# Altium schematic sheet Microcontroller.SchDoc
size 381 x 241 mm
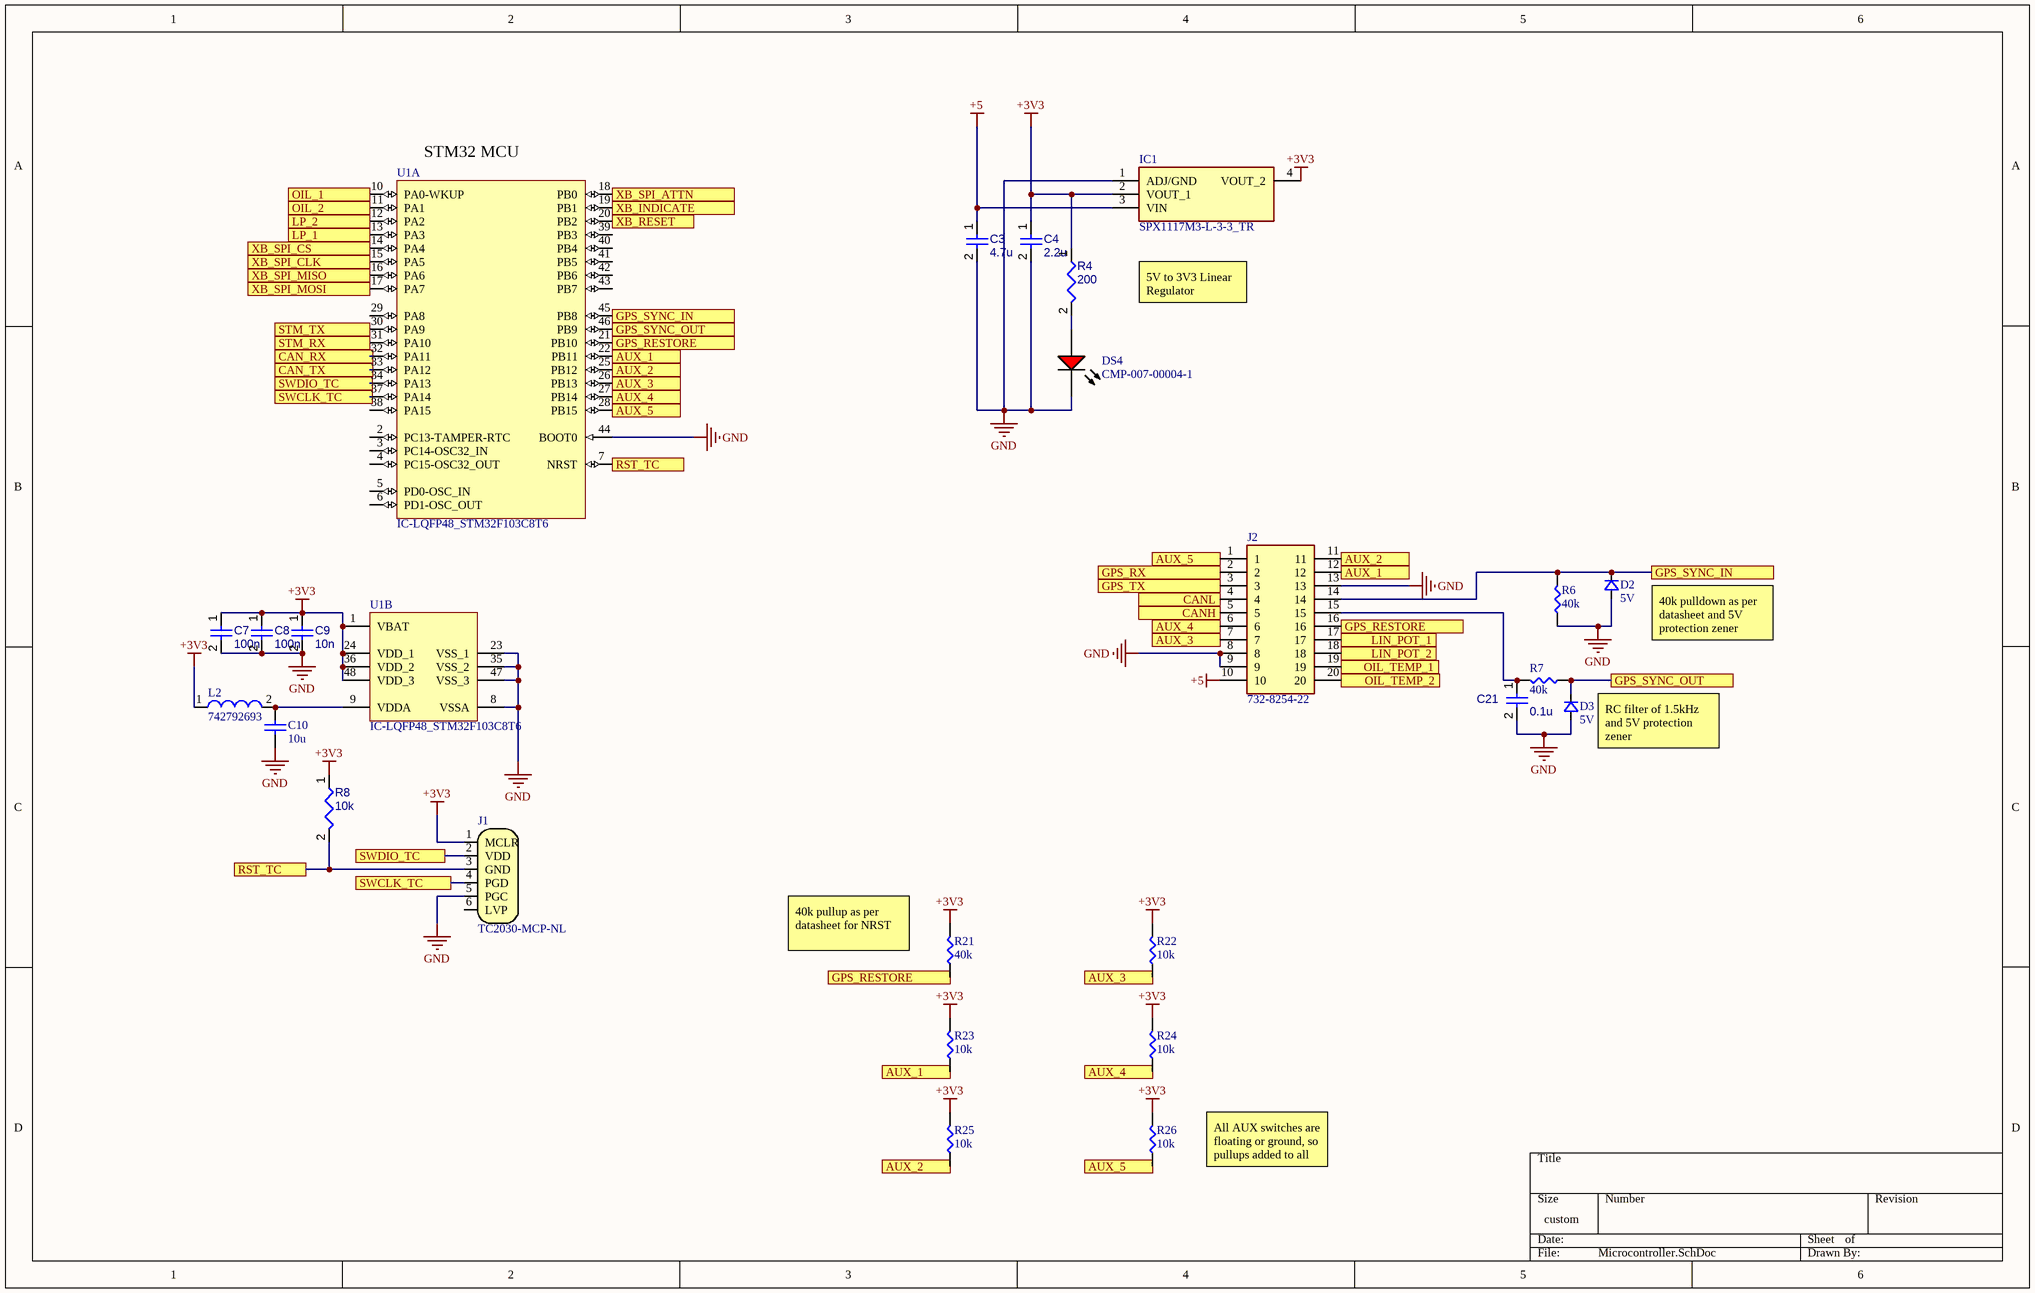
[diagram p0: Microcontroller.SchDoc]

## Parts
C3  4.7u  [CAPC0603(1608)100_L]
C4  2.2u  [CAPC0603(1608)100_L]
C7  100n  [CAPC0603(1608)100_L]
C8  100n  [CAPC0603(1608)100_L]
C9  10n  [CAPC0603(1608)100_L]
C10  10u  [CAPC1608X90X20ML10]
C21  0.1u  [CAPC0603(1608)100_L]
D2  5V  [SOD123]
D3  5V  [SOD123]
DS4  CMP-007-00004-1  [EVRL-0603-2_V]
IC1  SPX1117M3-L-3-3_TR  [SOT230P700X180-4N]
J1  TC2030-MCP-NL  [TC2030-MCP-NL]  (no BOM)
J2  732-8254-22  [732825422]
L2  742792693  [SMD-0603]
R4  200  [RESC0805(2012)_L]
R6  40k  [RES-0603]
R7  40k  [RES-0603]
R8  10k  [RESC0805(2012)_L]
R21  40k  [RES-0603]
R22  10k  [RES-0603]
R23  10k  [RES-0603]
R24  10k  [RES-0603]
R25  10k  [RES-0603]
R26  10k  [RES-0603]
U1  IC-LQFP48_STM32F103C8T6  [STM-LQFP48_M]  (parts A,B of 2)

## Ports
AUX_1, AUX_2, AUX_3, AUX_4, AUX_5, CAN_RX, CAN_TX, CANH, CANL, GPS_RESTORE, GPS_RX, GPS_SYNC_IN, GPS_SYNC_OUT, GPS_TX, LIN_POT_1, LIN_POT_2, LP_1, LP_2, OIL_1, OIL_2, OIL_TEMP_1, OIL_TEMP_2, RST_TC, STM_RX, STM_TX, SWCLK_TC, SWDIO_TC, XB_INDICATE, XB_RESET, XB_SPI_ATTN, XB_SPI_CLK, XB_SPI_CS, XB_SPI_MISO, XB_SPI_MOSI

## Nets
+3V3: C4.1 C7.1 C8.1 C9.1 IC1.2(VOUT_1) IC1.4(VOUT_2) J1.1(MCLR) L2.1 R4.1 R8.1 R21.2 R22.2 R23.2 R24.2 R25.2 R26.2 U1.1(VBAT) U1.24(VDD_1) U1.36(VDD_2) U1.48(VDD_3)
+5: C3.1 IC1.3(VIN) J2.10
GND: C3.2 C4.2 C7.2 C8.2 C9.2 C10.1 C21.2 D2.A D3.A DS4.2(K) IC1.1(ADJ/GND) J1.5(PGC) J2.8 J2.9 J2.13 R6.1 U1.8(VSSA) U1.23(VSS_1) U1.35(VSS_2) U1.44(BOOT0) U1.47(VSS_3)
AUX_1: J2.12 R23.1 U1.22(PB11) ; port AUX_1
AUX_2: J2.11 R25.1 U1.25(PB12) ; port AUX_2
AUX_3: J2.7 R22.1 U1.26(PB13) ; port AUX_3
AUX_4: J2.6 R24.1 U1.27(PB14) ; port AUX_4
AUX_5: J2.1 R26.1 U1.28(PB15) ; port AUX_5
CAN_RX: U1.32(PA11) ; port CAN_RX
CAN_TX: U1.33(PA12) ; port CAN_TX
CANH: J2.5 ; port CANH
CANL: J2.4 ; port CANL
GPS_RESTORE: J2.16 R21.1 U1.21(PB10) ; port GPS_RESTORE
GPS_RX: J2.2 ; port GPS_RX
GPS_SYNC_IN: D2.K J2.14 R6.2 U1.45(PB8) ; port GPS_SYNC_IN
GPS_SYNC_OUT: D3.K R7.1 U1.46(PB9) ; port GPS_SYNC_OUT
GPS_TX: J2.3 ; port GPS_TX
LIN_POT_1: J2.17 ; port LIN_POT_1
LIN_POT_2: J2.18 ; port LIN_POT_2
LP_1: U1.13(PA3) ; port LP_1
LP_2: U1.12(PA2) ; port LP_2
OIL_1: U1.10(PA0-WKUP) ; port OIL_1
OIL_2: U1.11(PA1) ; port OIL_2
OIL_TEMP_1: J2.19 ; port OIL_TEMP_1
OIL_TEMP_2: J2.20 ; port OIL_TEMP_2
RST_TC: J1.3(GND) R8.2 U1.7(NRST) ; port RST_TC
STM_RX: U1.31(PA10) ; port STM_RX
STM_TX: U1.30(PA9) ; port STM_TX
SWCLK_TC: J1.4(PGD) U1.37(PA14) ; port SWCLK_TC
SWDIO_TC: J1.2(VDD) U1.34(PA13) ; port SWDIO_TC
XB_INDICATE: U1.19(PB1) ; port XB_INDICATE
XB_RESET: U1.20(PB2) ; port XB_RESET
XB_SPI_ATTN: U1.18(PB0) ; port XB_SPI_ATTN
XB_SPI_CLK: U1.15(PA5) ; port XB_SPI_CLK
XB_SPI_CS: U1.14(PA4) ; port XB_SPI_CS
XB_SPI_MISO: U1.16(PA6) ; port XB_SPI_MISO
XB_SPI_MOSI: U1.17(PA7) ; port XB_SPI_MOSI
NetC10_2: C10.2 L2.2 U1.9(VDDA)
NetC21_1: C21.1 J2.15 R7.2
NetDS4_1: DS4.1(A) R4.2

Not connected (* = marked no-connect by the designer): J1 6(LVP); U1 2(PC13-TAMPER-RTC) 3(PC14-OSC32_IN) 4(PC15-OSC32_OUT) 5(PD0-OSC_IN) 6(PD1-OSC_OUT) 29(PA8) 38(PA15) 39(PB3) 40(PB4) 41(PB5) 42(PB6) 43(PB7)

## Notes on the sheet
- (near U1) STM32 MCU
- 5V to 3V3 Linear Regulator
- (near D2) 40k pulldown as per datasheet and 5V protection zener
- RC filter of 1.5kHz and 5V protection zener
- (near R21) 40k pullup as per datasheet for NRST
- All AUX switches are floating or ground, so pullups added to all inputs

## Library data of the parts
C3 C4 C7-C9 C21 = CMP-005-000563-1: Chip Capacitor, 1 uF, +/- 10%, 16 V, 0603 (1608 Metric); Voltage Rating: 16V; Capacitor Type: Ceramic; Value: 1µF; Available Preview Images: 2D; Pins: 2; Tolerance: 10%; Mounting Technology: SM; RoHS Compliant: True; Case/Package: 0603; Max Operating Temperature: 125°C; Min Operating Temperature: -55°C; Source: Integrated_Library - 12.03.21 - 15.39.SchLib; Design Item ID: CMP-001-00003-4
C10 = CMP-2000-04979-1: C1608X5R1A106K080AC - Chip Capacitor, 10 uF, +/- 10%, 10 V, -55 to 85 degC, 0603 (1608 Metric), RoHS, Tape and Reel; PCN Part Number: MLCCPartNumberChange30/Nov/2012; Manufacturer: TDK; Temperature Coefficient: X5R; Product Training Modules: CSeriesGeneralApplicationsSEAT,CCV,andTVCLDesignToolsGuidetoReplacinganElectrolyticCapacitorwithanMLCC; Online Catalog: CSeries,GeneralPurpose; Voltage - Rated: 10V; Other Names: 445-7486-1; Capacitance: 10µF; Design Resources: 20WNon-IsolatedBuckLEDDriverUsingPLLNK460KG; Kits: 445-9003-KIT-ND-KITCAPCERHICAPMLCCSMD; Height - Seated (Max): -; Family: CeramicCapacitors; Package Description: 2-Pin Surface Mount Device, Body 1.6 x 0.8 mm; Category: Capacitors; Datasheet Version: Mar-15; RoHS Information: RoHSCertificate-MLCC; Thickness (Max): 0.035"(0.90mm); Operating Temperature: -55degC~85degC; Package Reference: 603; Series: C; Applications: GeneralPurpose; Datasheet URL: http://download.siliconexpert.com/pdfs/2015/4/21/15/54/45/779/tdk_/manual/37024850441143360mlcc_commercial_general_en.pdf; Features: -; Lead Style: -; Lead Spacing: -; Ratings: -; Size / Dimension: 0.063"Lx0.031"W(1.60mmx0.80mm); Tolerance: ±10%; Mounting Type: SurfaceMount,MLCC; Standard Package: 1; Package / Case: 0603(1608Metric); Manufacturer URL: http://www.tdk.com/; Packaging: CutTape(CT)
D2 D3 = CMP-051-000177-1: Design Item ID: DIODE-SOD123; Source: ife19_Elec_Library.SchLib
DS4 = CMP-016-000003-1: Chip LED, Red, 5 V, 25 mA, -40 to 85 degC, 2-Pin SMD (0603), RoHS, Tape and Reel; Manufacturer: Everlight Electronics; Lens Style: Clear; Forward Voltage: 2.2V; Package Description: 2-Pin Surface Mount Device, Body 1.6 x 0.8 mm; RoHS Compliant: False; Mounting Technology: SM; Case/Package: 0603; Design Item ID: CMP-007-00004-1; Datasheet Version: Rev. 1, 01/2005; Source: Integrated_Library - 12.03.21 - 15.39.SchLib; Manufacturer URL: http://www.everlight.com/; Datasheet URL: https://datasheet.ciiva.com/4688/el-19-217-r6c-al1m2vy-3tpdf-187026-4688713.pdf; Package Reference: 0603; Colour: Red
IC1 = CMP-040-000003-1: Integrated Circuit; Manufacturer_Part_Number: SPX1117M3-L-3-3/TR; Manufacturer_Name: EXAR; Arrow Part Number: SPX1117M3-L-3-3/TR; Design Item ID: SPX1117M3-L-3-3_TR; Mouser Part Number: 701-SPX1117M3-L-33TR; Source: SamacSys.SchLib; Height: 1.8mm; Mouser Price/Stock: https://www.mouser.com/Search/Refine.aspx?Keyword=701-SPX1117M3-L-33TR; Datasheet Link: https://componentsearchengine.com/Datasheets/2/SPX1117M3-L-3-3_TR.pdf; Arrow Price/Stock: https://www.arrow.com/en/products/spx1117m3-l-3-3tr/exar
J1 = CMP-003-000769-1: Conector par ICD; Design Item ID: TC2030-MCP-NL; Source: Image Pasted at 2021-10-31 17-08.SchLib
J2 = CMP-045-000002-1: Rectangular Contact Inserts; Manufacturer_Name: TE Connectivity; Source: SamacSys.SchLib; Mouser Part Number: 571-732-8254-22; Mouser Price/Stock: https://www.mouser.co.uk/ProductDetail/TE-Connectivity-DEUTSCH/732-8254-22?qs=3oHdzXquMOypmJSB%252Be7EhA%3D%3D; Height: 14.2mm; Arrow Price/Stock: https://www.arrow.com/en/products/732-8254-22/deutsch-group; Design Item ID: 732-8254-22; Arrow Part Number: 732-8254-22; Manufacturer_Part_Number: 732-8254-22; Datasheet Link: https://www.te.com/commerce/DocumentDelivery/DDEController?Action=showdoc&DocId=Customer+Drawing%7F732-8254-22_X_XXXXX%7FG%7Fpdf%7FEnglish%7FENG_CD_732-8254-22_X_XXXXX_G.pdf%7FZPF000000000100304
L2 = CMP-0220-00111-1: SMD EMI Suppression Ferrite Bead WE-CBF, Z = 2200 Ohm; PackageDescription: Chip Inductor, 2-Leads, Body 1.6 x 0.8 mm; ComponentLink1URL: http://www.we-online.com; ComponentLink1Description: Manufacturer Link; DatasheetVersion: Dec-2005; PackageVersion: 2009; ComponentLink2URL: http://www.we-online.de/katalog/media/pdf/742792693.pdf; PackageReference: SMD-0603; Impedance: 2200 Ohm; ComponentLink2Description: Datasheet
R4 R8 = CMP-009-000172-1
R6 R7 R21-R26 = CMP-014-000032-1: Source: ife19_Elec_Library.SchLib; Design Item ID: RES-0603
U1 = CMP-056-001427-1: A/D Converter: 2x12-bit (10 Channel); FLASH Size (Prog) (kB): 64; Supply Voltage(Vcc) min (V): 2; Packing: Tray; Core: ARM Cortex-M3; Internal RAM Size (kB): 20; I/Os (High Current): 37; Operating Frequency(F) (Processor speed) (MHz): 72Hz; PackageReference: LQFP48; PackageDescription: 48-Pin Low Profile Quad Flat Package, 7 x 7 mm Body, 0.5 mm Pitch; ComponentLink1Description: Manufacturer URL; PackageVersion: Rev. 6, 06/2013; ComponentLink1URL: http://www.st.com/web/en/home.html; ComponentLink2Description: Datasheet; Mounting Technology: Surface Mount; PartNumber: STM32F103C8T6; ComponentLink2URL: http://www.st.com/st-web-ui/static/active/en/resource/technical/document/datasheet/CD00161566.pdf; ComponentLink3URL: http://www.st.com/st-web-ui/static/active/en/resource/technical/document/datasheet/DM00058181.pdf; Design Item ID: IC-LQFP48_STM32F103C8T6; Source: ife19_Elec_Library.SchLib; ComponentLink3Description: Package Specification; DatasheetVersion: Rev. 16